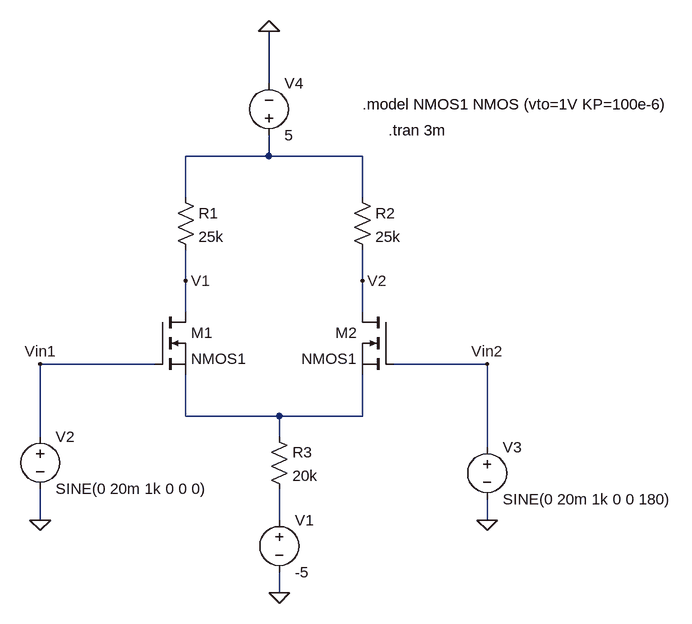
[diagram p0: schematic MOS diff amp.asc]
MOS diff amp.asc, the LTspice schematic file:
Version 4
SHEET 1 884 680
WIRE 240 -256 240 -336
WIRE 240 -144 240 -176
WIRE 240 -144 112 -144
WIRE 384 -144 240 -144
WIRE 112 -80 112 -144
WIRE 384 -80 384 -144
WIRE 112 48 112 0
WIRE 384 48 384 0
WIRE 112 96 112 48
WIRE 384 96 384 48
WIRE 64 176 -112 176
WIRE 576 176 432 176
WIRE 112 256 112 192
WIRE 256 256 112 256
WIRE 384 256 384 192
WIRE 384 256 256 256
WIRE -112 288 -112 176
WIRE 256 288 256 256
WIRE 576 304 576 176
WIRE -112 416 -112 368
WIRE 256 416 256 368
WIRE 576 416 576 384
WIRE 256 528 256 496
FLAG 240 -336 0
FLAG 256 528 0
FLAG -112 416 0
FLAG 576 416 0
FLAG 112 48 V1
FLAG 384 48 V2
FLAG 576 176 Vin2
FLAG -112 176 Vin1
SYMBOL res 96 -96 R0
SYMATTR InstName R1
SYMATTR Value 25k
SYMBOL res 368 -96 R0
SYMATTR InstName R2
SYMATTR Value 25k
SYMBOL voltage 256 400 R0
SYMATTR InstName V1
SYMATTR Value -5
SYMBOL voltage -112 272 R0
WINDOW 123 0 0 Left 0
WINDOW 39 0 0 Left 0
SYMATTR InstName V2
SYMATTR Value SINE(0 20m 1k 0 0 0)
SYMBOL voltage 576 288 R0
WINDOW 123 0 0 Left 0
WINDOW 39 0 0 Left 0
SYMATTR InstName V3
SYMATTR Value SINE(0 20m 1k 0 0 180)
SYMBOL voltage 240 -160 M180
WINDOW 0 24 96 Left 2
WINDOW 3 24 16 Left 2
SYMATTR InstName V4
SYMATTR Value 5
SYMBOL nmos 64 96 R0
SYMATTR InstName M1
SYMATTR Value NMOS1
SYMBOL nmos 432 96 M0
SYMATTR InstName M2
SYMATTR Value NMOS1
SYMBOL res 240 272 R0
SYMATTR InstName R3
SYMATTR Value 20k
TEXT 384 -224 Left 2 !.model NMOS1 NMOS (vto=1V KP=100e-6)
TEXT 424 -184 Left 2 !.tran 3m

The netlist it stands for:
* MOS diff amp.asc
R1 N001 V1 25k
R2 N001 V2 25k
V1 N003 0 -5
V2 Vin1 0 SINE(0 20m 1k 0 0 0)
V3 Vin2 0 SINE(0 20m 1k 0 0 180)
V4 N001 0 5
M1 V1 Vin1 N002 N002 NMOS1
M2 V2 Vin2 N002 N002 NMOS1
R3 N002 N003 20k
.model NMOS NMOS
.model PMOS PMOS
.lib standard.mos
.model NMOS1 NMOS (vto=1V KP=100e-6)
.tran 3m
.backanno
.end